# Altium schematic sheet 02_FPGA Bank0.SchDoc
size 297 x 209 mm
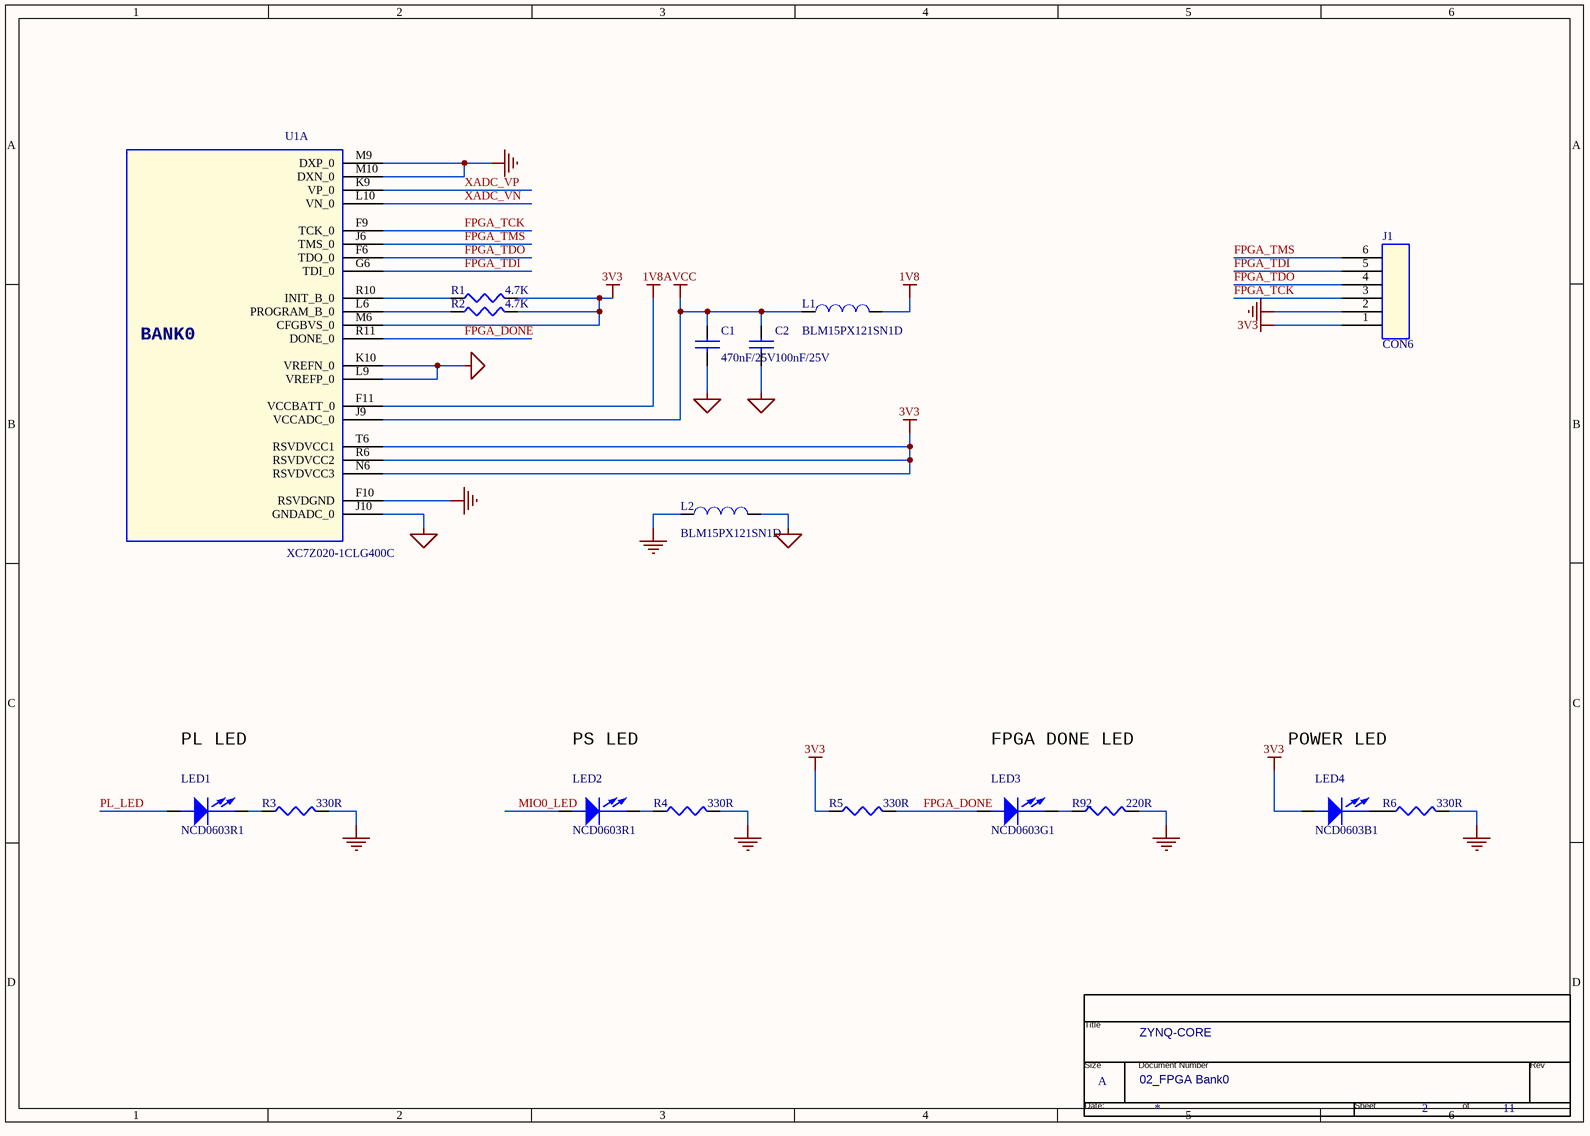
[diagram p0: 02_FPGA Bank0.SchDoc]

## Parts
*  Page Count: 11  Page Number: 2  Page Size: A  Title: ZYNQ-CORE  Doc: 02_FPGA Bank0  (hidden comment: TitleBlock0)  (graphical)
C1  470nF/25V  [C0402]
C2  100nF/25V  [C0402]
J1  CON6  [HDR1X6]
L1  BLM15PX121SN1D  [L0402]
L2  BLM15PX121SN1D  [L0402]
LED1  NCD0603R1  [LED0603_M_RED]
LED2  NCD0603R1  [LED0603_M_RED]
LED3  NCD0603G1  [LED0603_M_GREEN]
LED4  NCD0603B1  [LED0603_M_BLUE]
R1  4.7K  [R0402A]
R2  4.7K  [R0402A]
R3  330R  [R0402]
R4  330R  [R0402]
R5  330R  [R0402]
R6  330R  [R0402]
R92  220R  [R0402]
U1  XC7Z020-1CLG400C  [CLG400]  (part A of 9)

## Nets
1V8: L1.2 U1.F11(VCCBATT_0)
3V3: J1.1 LED4.1(ANODE) R1.2 R2.2 R5.1 U1.M6(CFGBVS_0) U1.N6(RSVDVCC3) U1.R6(RSVDVCC2) U1.T6(RSVDVCC1)
AGND: C1.2 C2.2 L2.2 U1.J10(GNDADC_0) U1.K10(VREFN_0) U1.L9(VREFP_0)
AVCC: C1.1 C2.1 L1.1 U1.J9(VCCADC_0)
GND: J1.2 L2.1 R3.2 R4.2 R6.2 R92.2 U1.F10(RSVDGND) U1.M9(DXP_0) U1.M10(DXN_0)
FPGA_DONE: LED3.1(ANODE) R5.2 U1.R11(DONE_0)
FPGA_TCK: J1.3 U1.F9(TCK_0)
FPGA_TDI: J1.5 U1.G6(TDI_0)
FPGA_TDO: J1.4 U1.F6(TDO_0)
FPGA_TMS: J1.6 U1.J6(TMS_0)
MIO0_LED: LED2.1(ANODE)
PL_LED: LED1.1(ANODE)
XADC_VN: U1.L10(VN_0)
XADC_VP: U1.K9(VP_0)
NetLED1_2: LED1.2(CATHODE) R3.1
NetLED2_2: LED2.2(CATHODE) R4.1
NetLED3_2: LED3.2(CATHODE) R92.1
NetLED4_2: LED4.2(CATHODE) R6.1
NetR1_1: R1.1 U1.R10(INIT_B_0)
NetR2_1: R2.1 U1.L6(PROGRAM_B_0)

## Notes on the sheet
- PL LED
- PS LED
- FPGA DONE LED
- POWER LED
- (in symbol TitleBlock0) Title; Size; Document Number; Rev; Date:; Sheet; of
- (in symbol Zynq7010/7020, part A) BANK0

## Library data of the parts
C1 C2 = CAP NP_Dup1: PCB Footprint: C0402
L1 L2 = INDUCTOR_Dup1: PCB Footprint: L0402
LED1 LED2 = LED: 红色; PCB Footprint: LED0805
LED3 = LED: 绿色; PCB Footprint: LED0805
LED4 = LED: 蓝色; PCB Footprint: LED0805
R1 R2 = RESISTOR_Dup1: PCB Footprint: R0402
R3-R6 R92 = RESISTOR_Dup1: PCB Footprint: R0402
U1 = Zynq7010/7020: PCB Footprint: CLG400
* = TitleBlock0: Page Create Date: March  8, 1995; Page Modify Date: *
J1 = CON6: PCB Footprint: HDR1X6